# Altium schematic sheet 5v_BOOST.SchDoc
size A
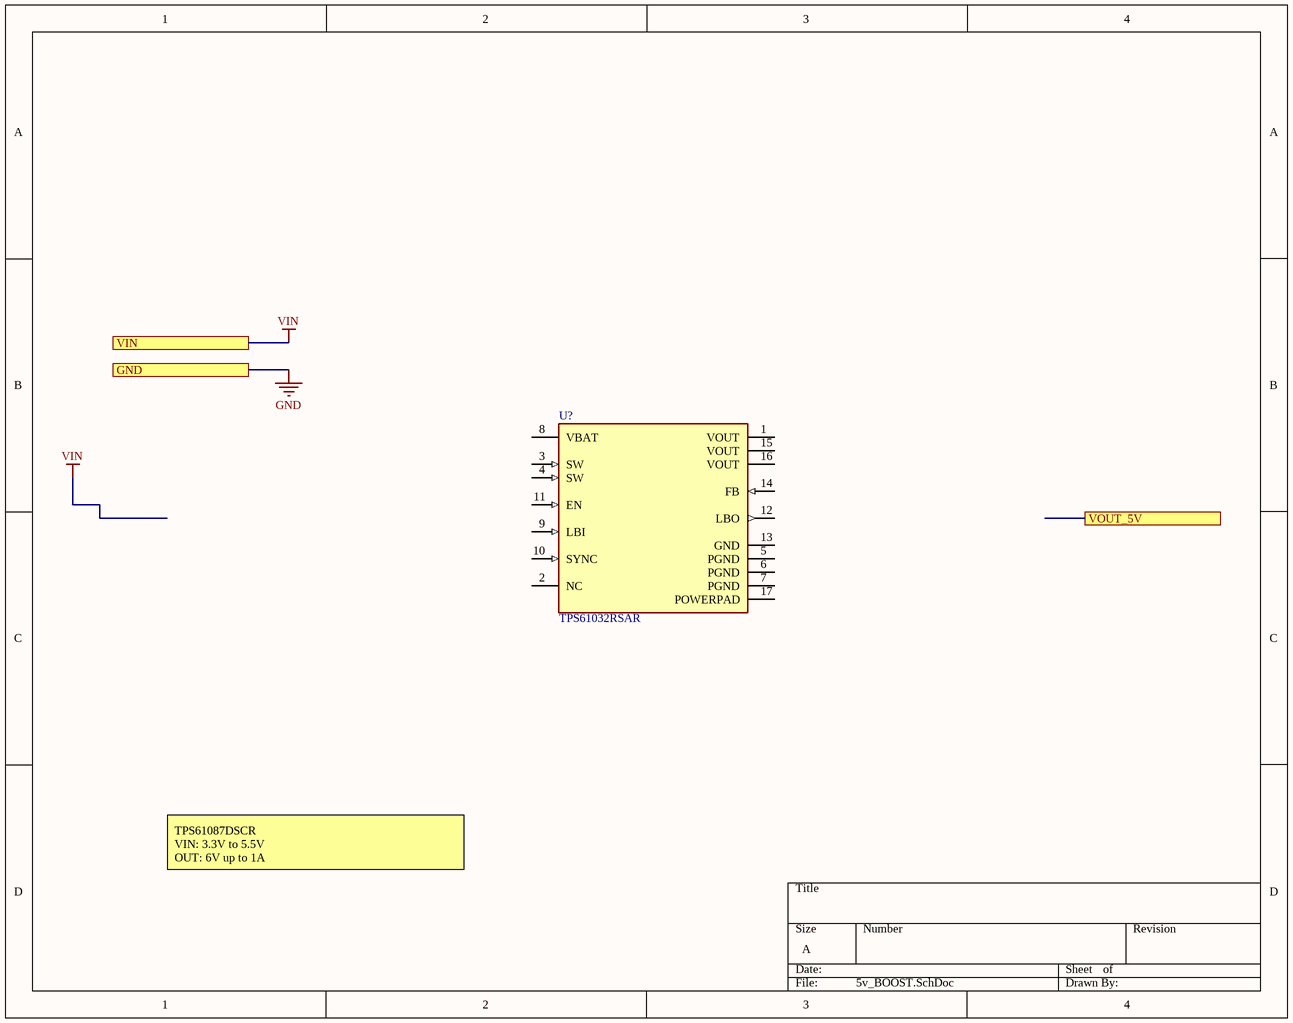
[diagram p0: 5v_BOOST.SchDoc]

## Parts
U?  TPS61032RSAR  [FP-RSA0016B-IPC_C]

## Ports
GND, VIN, VOUT_5V

## Nets
GND: port GND
VIN: port VIN

Not connected (* = marked no-connect by the designer): U? 1(VOUT) 2(NC) 3(SW) 4(SW) 5(PGND) 6(PGND) 7(PGND) 8(VBAT) 9(LBI) 10(SYNC) 11(EN) 12(LBO) 13(GND) 14(FB) 15(VOUT) 16(VOUT) 17(POWERPAD)

## Notes on the sheet
- TPS61087DSCR
  VIN: 3.3V to 5.5V
  OUT: 6V up to 1A

## Library data of the parts
U? = CMP-04918-000257-1: IC REG BOOST 5V 3.6A 16QFN; Min Input Voltage: 1.8V; Quiescent Current: 20uA; Max Output Current: 1A; Output Configuration: Positive; Max Input Voltage: 5.5V; Number of Outputs: 1; Synchronous Rectifier: Yes; Switching Frequency: 600kHz; Output Type: Fixed; Efficiency: 96%; Nominal Output Voltage: 5V; Number of Pins: 16; Packaging: Tape and Reel; Width: 4mm; Package Quantity: 1; RoHS Compliant: Yes; Case/Package: VQFN; Min Output Voltage: 5V; Mount: Surface Mount; REACH SVHC: No SVHC; Operating Supply Voltage: 5.5V; Output Current: 1A; Radiation Hardening: No; Series: -; Max Operating Temperature: 85°C; Topology: Boost; Min Operating Temperature: -40°C; Lead Free: Lead Free; Output Voltage: 5V; Weight: 0.001464oz